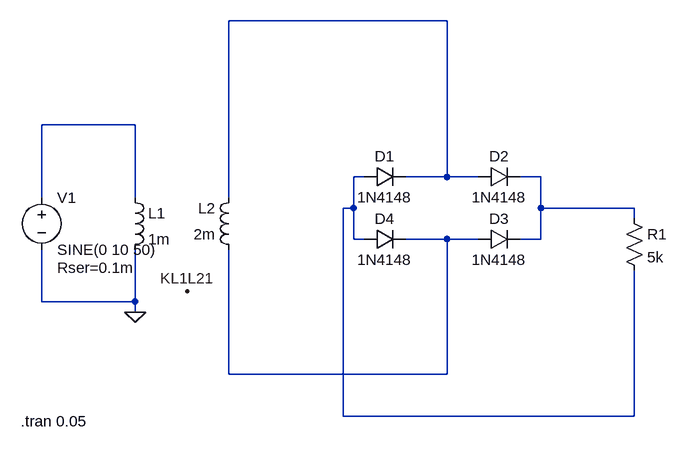
[diagram p0: schematic Draft6.asc]
Draft6.asc, the LTspice schematic file:
Version 4
SHEET 1 880 680
WIRE 256 -112 -80 -112
WIRE -224 48 -368 48
WIRE 128 128 112 128
WIRE 256 128 256 -112
WIRE 256 128 192 128
WIRE 304 128 256 128
WIRE 400 128 368 128
WIRE -368 160 -368 48
WIRE -224 160 -224 48
WIRE -80 160 -80 -112
WIRE 112 176 112 128
WIRE 112 176 96 176
WIRE 400 176 400 128
WIRE 544 176 400 176
WIRE 544 192 544 176
WIRE 112 224 112 176
WIRE 128 224 112 224
WIRE 256 224 192 224
WIRE 304 224 256 224
WIRE 400 224 400 176
WIRE 400 224 368 224
WIRE -368 320 -368 240
WIRE -224 320 -224 240
WIRE -224 320 -368 320
WIRE -224 336 -224 320
WIRE -80 432 -80 240
WIRE 256 432 256 224
WIRE 256 432 -80 432
WIRE 96 496 96 176
WIRE 544 496 544 272
WIRE 544 496 96 496
FLAG -224 336 0
FLAG -144 304 KL1L21
SYMBOL diode 128 144 R270
WINDOW 0 32 32 VTop 2
WINDOW 3 0 32 VBottom 2
SYMATTR InstName D1
SYMATTR Value 1N4148
SYMBOL diode 304 144 R270
WINDOW 0 32 32 VTop 2
WINDOW 3 0 32 VBottom 2
SYMATTR InstName D2
SYMATTR Value 1N4148
SYMBOL diode 304 240 R270
WINDOW 0 32 32 VTop 2
WINDOW 3 0 32 VBottom 2
SYMATTR InstName D3
SYMATTR Value 1N4148
SYMBOL diode 128 240 R270
WINDOW 0 32 32 VTop 2
WINDOW 3 0 32 VBottom 2
SYMATTR InstName D4
SYMATTR Value 1N4148
SYMBOL ind -240 144 R0
SYMATTR InstName L1
SYMATTR Value 1m
SYMBOL ind -64 256 R180
WINDOW 0 36 80 Left 2
WINDOW 3 36 40 Left 2
SYMATTR InstName L2
SYMATTR Value 2m
SYMBOL voltage -368 144 R0
WINDOW 123 0 0 Left 0
WINDOW 39 24 124 Left 2
SYMATTR InstName V1
SYMATTR Value SINE(0 10 50)
SYMATTR SpiceLine Rser=0.1m
SYMBOL res 528 176 R0
SYMATTR InstName R1
SYMATTR Value 5k
TEXT -400 504 Left 2 !.tran 0.05

The netlist it stands for:
* Draft6.asc
D1 N003 N001 1N4148
D2 N001 N004 1N4148
D3 N005 N004 1N4148
D4 N003 N005 1N4148
L1 N002 0 1m
L2 N005 N001 2m
V1 N002 0 SINE(0 10 50) Rser=0.1m
R1 N004 N003 5k
.model D D
.lib standard.dio
.tran 0.05
.backanno
.end